# Altium schematic sheet digital.SchDoc
size A4
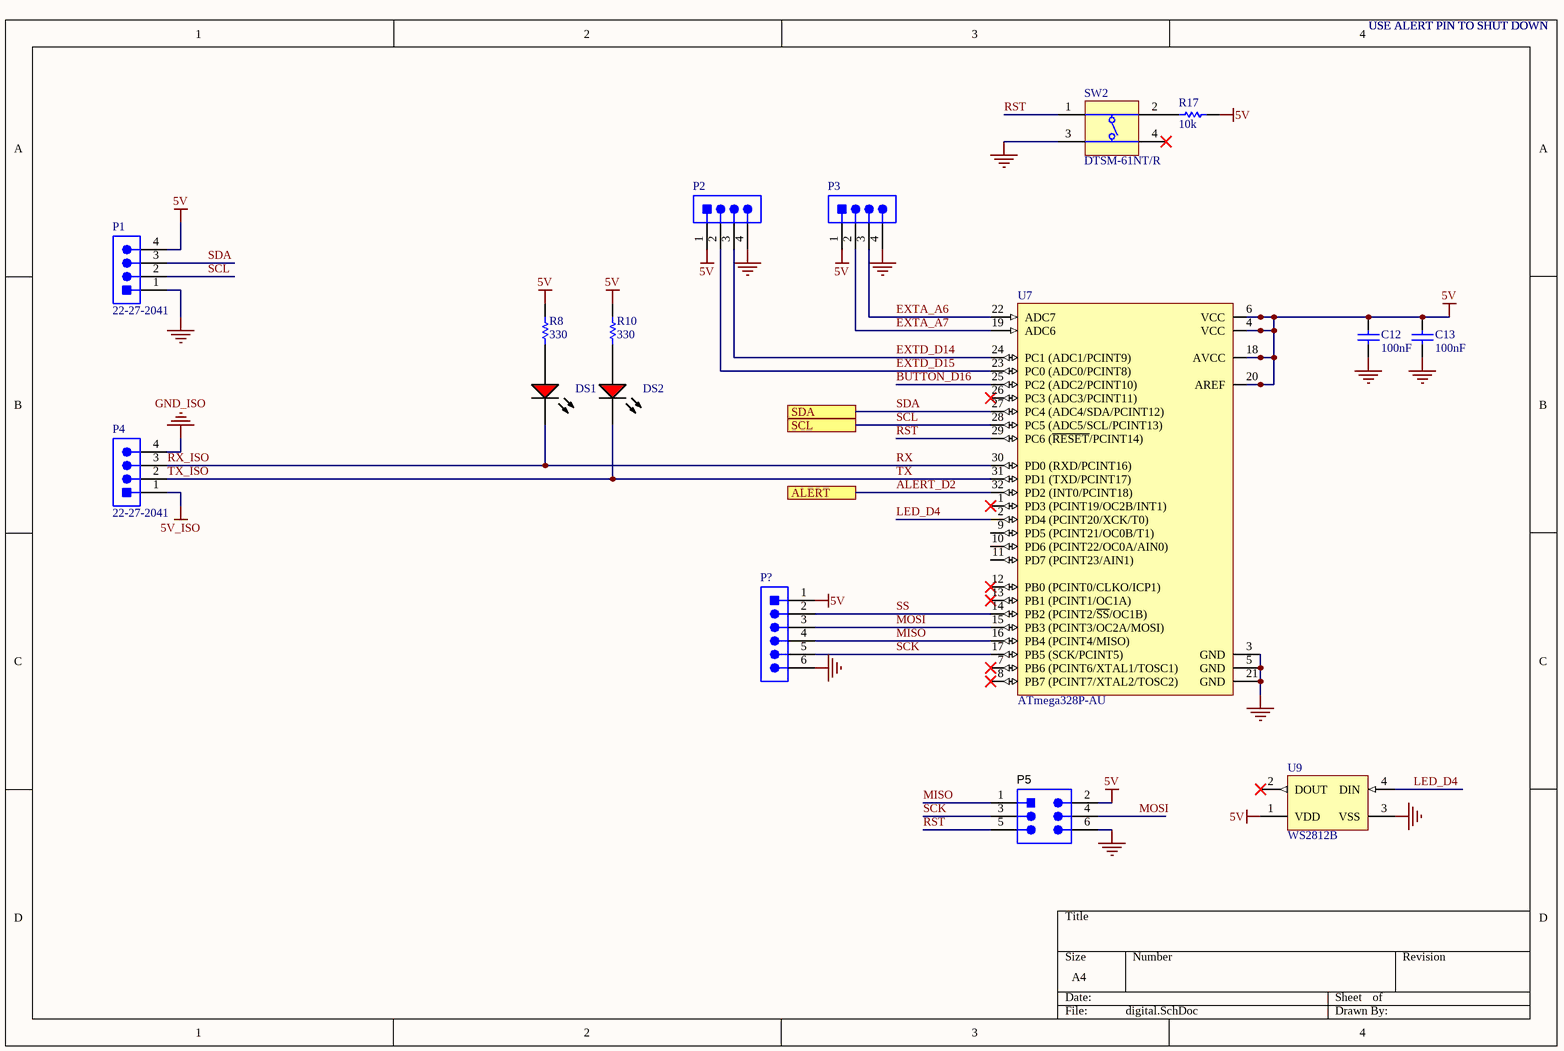
[diagram p0: digital.SchDoc]

## Parts
C12  100nF  [CAPC0805(2012)100_L]
C13  100nF  [CAPC0805(2012)100_L]
DS1  TLMS1100-GS08  [VISH-TLMX1100_V]  (value not drawn)
DS2  TLMS1100-GS08  [VISH-TLMX1100_V]  (value not drawn)
P1  22-27-2041  [MOLX-22-27-2041_V]
P2  22-27-2041  [MOLX-22-27-2041_V]  (value not drawn)
P3  22-27-2041  [MOLX-22-27-2041_V]  (value not drawn)
P4  22-27-2041  [MOLX-22-27-2041_V]
P5  5-146130-2  [TECO-5-146130-2_V]  (value not drawn)
P?  22-23-2061  [MOLX-22-23-2061_V]  (value not drawn)
R8  330  [RESC0805(2012)_L]
R10  330  [RESC0805(2012)_L]
R17  10k  [RESC0805(2012)_L]
SW2  DTSM-61NT/R  [DIPT-DTSM-6_V]
U7  ATmega328P-AU  [32A_M]
U9  WS2812B  [ADAI-WS2812B_V]

## Ports
ALERT, SCL, SDA

## Nets
5V: C12.2 C13.2 P1.4 P2.1 P3.1 P5.2 P?.1 R8.1 R10.1 R17.2 U7.4(VCC) U7.6(VCC) U7.18(AVCC) U7.20(AREF) U9.1(VDD)
5V_ISO: P4.1
GND: C12.1 C13.1 P1.1 P2.4 P3.4 P5.6 P?.6 SW2.3(T3) U7.3(GND) U7.5(GND) U7.21(GND) U9.3(VSS)
GND_ISO: P4.4
ALERT_D2: U7.32(PD2_(INT0/PCINT18)) ; port ALERT
BUTTON_D16: U7.25(PC2_(ADC2/PCINT10))
EXTA_A6: P3.3 U7.22(ADC7)
EXTA_A7: P3.2 U7.19(ADC6)
EXTD_D14: P2.3 U7.24(PC1_(ADC1/PCINT9))
EXTD_D15: P2.2 U7.23(PC0_(ADC0/PCINT8))
LED_D4: U7.2(PD4_(PCINT20/XCK/T0)) U9.4(DIN)
MISO: P5.1 P?.4 U7.16(PB4_(PCINT4/MISO))
MOSI: P5.4 P?.3 U7.15(PB3_(PCINT3/OC2A/MOSI))
RST: P5.5 SW2.1(T1) U7.29(PC6_(~{RESET}/PCINT14))
RX: DS1.2(K) P4.3 U7.30(PD0_(RXD/PCINT16))  [also labelled RX_ISO]
SCK: P5.3 P?.5 U7.17(PB5_(SCK/PCINT5))
SCL: P1.2 U7.28(PC5_(ADC5/SCL/PCINT13)) ; port SCL
SDA: P1.3 U7.27(PC4_(ADC4/SDA/PCINT12)) ; port SDA
SS: P?.2 U7.14(PB2_(PCINT2/~{SS}/OC1B))
TX: DS2.2(K) P4.2 U7.31(PD1_(TXD/PCINT17))  [also labelled TX_ISO]
NetDS1_1: DS1.1(A) R8.2
NetDS2_1: DS2.1(A) R10.2
NetR17_1: R17.1 SW2.2(T2)

Not connected (* = marked no-connect by the designer): SW2 4(T3)*; U7 1(PD3_(PCINT19/OC2B/INT1))* 7(PB6_(PCINT6/XTAL1/TOSC1))* 8(PB7_(PCINT7/XTAL2/TOSC2))* 9(PD5_(PCINT21/OC0B/T1)) 10(PD6_(PCINT22/OC0A/AIN0)) 11(PD7_(PCINT23/AIN1)) 12(PB0_(PCINT0/CLKO/ICP1))* 13(PB1_(PCINT1/OC1A))* 26(PC3_(ADC3/PCINT11))*; U9 2(DOUT)*

## Notes on the sheet
- USE ALERT PIN TO SHUT DOWN

## Library data of the parts
C12 C13 = CMP-1036-04734-1: Tolerance: Â±20%; Case-Metric: 2012; Rated Voltage: 6.3 V; Value: 1uF; Case-EIA: 0805; Max Thickness: 1 mm; Technology: SMT
DS1 DS2 = CMP-1666-00027-1: LED, RED, 2.1 V, -40 to 100 degC, 2-Pin SMD (0603), RoHS, Tape and Reel; Type (Capacitors): C0G; Resistance: 100000000000 Ohm; Capacitance: 12 pF; Voltage Rating: 50 V; Tolerance: 5%; Min Operating Temperature: -55degC; REACH SVHC: No SVHC; ComponentLink2Description: Datasheet; ComponentLink1URL: http://www.vishay.com/; Width: 0.8 mm; Package Quantity: 4000; PackageReference: TLMX1100; ComponentLink2URL: http://www.vishay.com/docs/83173/tlmb1100.pdf; Case/Package: 0603; Case Code (Metric): 1608; Packaging: Tape and Reel; Pins: 2; ComponentLink1Description: Manufacturer URL; Max Operating Temperature: 125degC; Height: 0.8 mm; Length: 1.6 mm; Mount: Surface Mount; PackageDescription: 2-Pin Surface Mount Device, Body 1.6 x 0.8 mm; DatasheetVersion: Rev. 2.7, 03/2016; Case Code (Imperial): 0603; Voltage Rating (DC): 50 V; RoHSCompliant: True; Radiation Hardening: No
P1-P4 = CMP-2000-05243-1: Male Header, Pitch 2.54 mm, 1 x 4 Position, Height 11.7 mm, Tail Length 3.56 mm, RoHS, Bulk; Manufacturer: Molex; Voltage rating: 250V; Current rating: 4A; Datasheet Version: Rev. F, 06/2009; Operating temperature: 0degCto+75degC; Contact material: Tinplatedbrass; Manufacturer URL: http://www.molex.com/; Housing material: Nylon(UL94V-0); Datasheet URL: http://www.molex.com/pdm_docs/sd/022272041_sd.pdf
P5 = CMP-1684-00011-1: Male Header, Pitch 2.54 mm, 2 x 3 Position, Height 8.13 mm, -65 to 125 degC, RoHS, Tube; Max Supply Voltage: 5.5 V; Min Supply Voltage: 4.5 V; Nominal Supply Voltage: 5 V; Min Operating Temperature: -40 degC; ComponentLink1URL: http://www.te.com/; ComponentLink2Description: Datasheet; Pins: 3; Max Operating Temperature: 150 degC; PackageDescription: Male Header, Pitch 2.54 mm, 2 x 3 Position, Height 8.13 mm; Package Quantity: 3000; PackageReference: 5-146130-2; DatasheetVersion: Oct-15; ComponentLink1Description: Manufacturer URL; Radiation Hardening: No; Mount: Surface Mount; RoHSCompliant: true; Packaging: Tape and Reel; ComponentLink2URL: http://www.te.com/commerce/DocumentDelivery/DDEController?Action=showdoc&DocId=Customer+Drawing%7F146130%7FM%7Fpdf%7FEnglish%7FENG_CD_146130_M.pdf%7F5-146130-2
P? = CMP-2000-05536-1: Male Header, Pitch 2.54 mm, 1 x 6 Position, Height 10.67 mm, Tail Length 3.56 mm, 0 to 70 degC, RoHS, Bulk; Manufacturer: Molex; Pitch: 2.54mm; Mounting Angle: Vertical; Current Rating: 4A; Number of Positions / Contacts: 6; Voltage Rating: 250V; Packaging: Bulk; Package Description: Male Header, Pitch 2.54 mm, 1 x 6 Position, Height 10.67 mm, Tail Length 3.56 mm; Number of Rows: 1; Type: PinStrip; Contact Material: Brass; Product Category: .100K.K.Connectors; Factory Pack Quantity: 1000; Mounting Style: ThroughHole; RoHS: Details; Contact Plating: Tin; Housing Material: Nylon; Mounting Technology: ThroughHole; Termination Style: ThroughHole; Tradename: KK; Number of Positions: 6; Brand: Molex; Product Type: Headers; Series: 6373; Datasheet URL: https://datasheet.ciiva.com/19460/232303-19460895.pdf; Package Reference: 22-23-2061; Datasheet Version: Rev. P, 09/2001; Manufacturer URL: http://www.molex.com/
R8 R10 = CMP-1013-00624-1: 10K2 0.125W 1% 0805 (2012 Metric)  SMD; Case-Metric: 2012; Case-EIA: 0805; Value: 10200.00 Ohm; Technology: SMT; Tolerance: 1 %; Power: 0.125 W
R17 = CMP-1013-00397-1: Value: 100.00 Ohm; Power: 0.125 W; Case-Metric: 2012; Case-EIA: 0805; Tolerance: 1 %; Technology: SMT
SW2 = CMP-0306-00001-1: Switch, SPNO Push Button SMD; Manufacturer: Diptronics; Packing Type: Tape&Reel; Mechanical Life: 200,000 cycles; ComponentLink2URL: http://www.dip.com.tw/Products_tact.htm; ComponentLink1URL: http://www.dip.com.tw/; ComponentLink3URL: http://www.dip.com.tw/PDF/pro_tact/DTSM_G_-6_2_-V.pdf; PackageDescription: Switch, Through-Hole, 4 Leads, Body 8.5x8.5mm, Row Spacing 9.0mm, Pitch 4.5mm; ComponentLink2Description: Datasheet; ComponentLink3Description: Package Specification; ComponentLink1Description: Manufacturer URL; PackageReference: DTSM-6; PartNumber: DTSM-61NT/R; Mounting Technology: Through Hole
U7 = CMP-0095-00269-2: 8-bit AVR Microcontroller, 32KB Flash, 1KB EEPROM, 2KB SRAM, 32-pin TQFP, Industrial Grade (-40°C to 85°C); PackageDescription: 32-Lead, 7x7x1.0 mm Body, 0.8mm Lead Pitch, Thin Profile Plastic Quad Flat Package (TQFP); DatasheetVersion: revD, May-2011; RevisionNote: DatasheetVersion & PackageVersion updated. URLs added.; ComponentLink1URL: http://www.atmel.com/; ComponentLink2Description: ATmega48A/48PA/88A/88PA/168A/168PA/328/328P Datasheet; Code_JEDEC: MS-026-ABA; ComponentLink1Description: Manufacturer URL; PackageReference: 32A; ComponentLink3Description: ATmega48A/48PA/88A/88PA/168A/168PA/328/328P Summary; ComponentLink2URL: http://www.atmel.com/dyn/resources/prod_documents/doc8271.pdf; PackageVersion: revC, Oct-2010; ComponentLink3URL: http://www.atmel.com/dyn/resources/prod_documents/8271S.pdf
U9 = CMP-1740-00005-1: Intelligent Control LED Integrated Light Source, 3.5 to 5.3 V, -25 to 80 degC, 4-Pin SMD, RoHS, Bulk; Case\Package: Radial; Shielding: Unshielded; Current Rating: 240 mA; Tolerance: 10%; Mount: Through Hole; Max Operating Temperature: 125 degC; Radiation Hardening: No; Length: 12.2 mm; Min Operating Temperature: -55 degC; ComponentLink1URL: https://www.adafruit.com/; Packaging: Bulk; Lead Pitch: 5 mm; RoHSCompliant: true; Pins: 2; Package Quantity: 200; ComponentLink2URL: https://cdn-shop.adafruit.com/datasheets/WS2812B.pdf; ComponentLink2Description: Datasheet; PackageDescription: 4-Pin Surface Mount Device, Body 5 x 5 mm, Pitch 3.3 mm; PackageReference: WS2812B; Height: 12.2 mm; REACH SVHC: No SVHC; ComponentLink1Description: Manufacturer URL; DatasheetVersion: May-13